# Altium schematic sheet Buck6Vto3.3V.SchDoc
size A
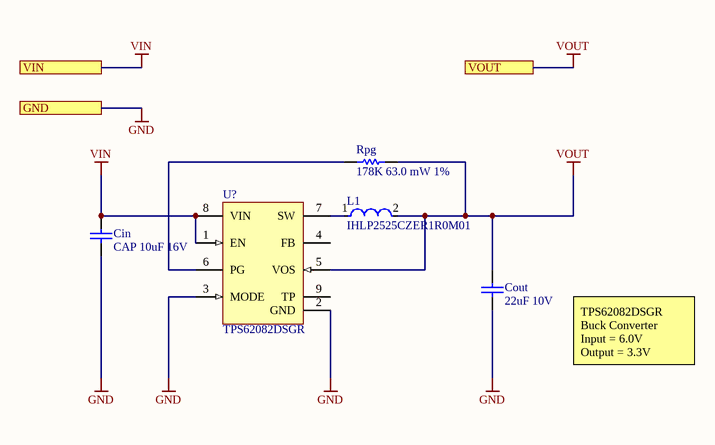
[diagram p0: Buck6Vto3.3V.SchDoc]

## Parts
Cin  CAP 10uF 16V  [CAPC0805(2012)145_N]
Cout  22uF 10V  [CAPC0805(2012)145_N]
L1  IHLP2525CZER1R0M01  [FP-IHLP-2525CZ-FP_2_413x3-MFG]
Rpg  178K 63.0 mW 1%  [RESC0603(1608)_N]
U?  TPS62082DSGR  [DSG8-1600X900TP]

## Ports
GND, VIN, VOUT

## Nets
GND: Cin.1 Cout.1 U?.2(GND) U?.3(MODE) ; port GND
VIN: Cin.2 U?.1(EN) U?.8(VIN) ; port VIN
VOUT: Cout.2 L1.2 Rpg.2 U?.5(VOS) ; port VOUT
NetL1_1: L1.1 U?.7(SW)
NetRpg_1: Rpg.1 U?.6(PG)

Not connected (* = marked no-connect by the designer): U? 4(FB) 9(TP)

## Notes on the sheet
- TPS62082DSGR
  Buck Converter
  Input = 6.0V
  Output = 3.3V

## Library data of the parts
Cin = CMP-1036-04927-1: CAP 10uF 16V ±10% 0805 (2012 Metric) Thickness 1.45mm SMD; Manufacturer: Kyocera AVX; Manufacturer Part Number: 0805YD106KAT2A; Manufacturer: KEMET; Manufacturer Part Number: C0805C106K4PACTU; Manufacturer: TDK; Manufacturer Part Number: C2012X5R1C106K/0.85; Manufacturer Part Number: C2012X6S1C106K; Manufacturer Part Number: C0805C106K4PAC; Manufacturer Part Number: 0805YD106KAT4A; Manufacturer Part Number: C2012X5R1C106K/1.25; Case-EIA: 0805; Tolerance: Â±10%; Case-Metric: 2012; Rated Voltage: 16 V; Technology: SMT; Value: 10uF; Max Thickness: 1.45 mm
Cout = CMP-1036-04943-1: CAP 22uF 10V ±20% 0805 (2012 Metric) Thickness 1.45mm SMD; Manufacturer: TDK; Manufacturer Part Number: C2012X5R1A226M/0.85; Manufacturer Part Number: C2012X5R1A226M/1.25; Manufacturer Part Number: C2012X6S1A226M; Case-Metric: 2012; Case-EIA: 0805; Tolerance: Â±20%; Rated Voltage: 10 V; Max Thickness: 1.45 mm; Technology: SMT; Value: 22uF
L1 = CMP-02424-000599-1: Commercial Inductors, High Saturation Series 1uH 11A 10mΩ 20%; Self Resonant Frequency: 5MHz; Test Frequency: 100kHz; Shielding: Shielded; Core Material: Metal; Saturation Current: 22A; DC Resistance (DCR): 10mR; Current Rating: 11A; Packaging: Tape and Reel; Width: 6.47mm; Number of Pins: 2; Case/Package: 2525; Termination: SMD/SMT; Length: 7.24mm; Height: 3mm; Min Operating Temperature: -55°C; Mount: Surface Mount; Inductance Tolerance: 20%; Max Operating Temperature: 125°C; Military Standard: Not; Max DC Current: 11A; RMS Current (Irms): 11A; Lead Free: Lead Free; Depth: 6.72mm; Tolerance: 20%; Package Quantity: 2000; Radiation Hardening: No; Contact Plating: Tin; Inductance: 1uH
Rpg = CMP-1012-00756-1: 178K  1% 0603 (1608 Metric)  SMD; Manufacturer: Panasonic; Manufacturer Part Number: ERJ-3EKF1583V; Manufacturer: Bourns; Manufacturer Part Number: CR0603-FX-1583ELF; Manufacturer: Vishay Dale; Manufacturer Part Number: CRCW0603158KFKEB; Manufacturer: Yageo; Manufacturer Part Number: RC0603FR-07158KL; Manufacturer: Vishay; Manufacturer Part Number: CRCW0603158KFKEA; Manufacturer Part Number: CRCW0603158KFKTA; Power: 0.1 W; Value: 158000.00 Ohm; Case-Metric: 1608; Case-EIA: 0603; Tolerance: 1 %; Technology: SMT
U? = CMP-0323-00344-2: Buck Step Down Regulator with 2.3 to 6 V Input and 3.3 V Output, -40 to 85 degC, 8-Pin WSON (DSG), Green (RoHS & no Sb/Br); Manufacturer: Texas Instruments; Duty Cycle(Max)(%): 100; Iq(Typ)(mA): 0.006; Rating: Catalog; Regulated Outputs(#): 1; Vout(Min)(V): 3.3; SubFamily: Step-Down Regulator; Vin(Max)(V): 6; Iout(Max)(A): 1.2; Vin(Min)(V): 2.3; Switch Current Limit(Typ)(A): 2.4; ComponentLink1Description: Datasheet; PackageReference: DSG8-1600X900TP; ComponentLink2Description: Package Specification; PackageDescription: 8-Pin Plastic Small Outline No-Lead, 2 x 2 x 0.8 mm Body, 0.5 mm Pitch, Exposed Pad; DatasheetVersion: SLVSAE8B; PackageVersion: revB, Oct-2010; Eco-Plan: Green (RoHS & no Sb/Br); Code_JEDEC: MO-229; PartNumber: TPS62082DSGR; ComponentLink1URL: http://www.ti.com/general/docs/lit/getliterature.tsp?genericPartNumber=TPS62082&fileType=pdf; ComponentLink2URL: http://www.ti.com/litv/pdf/mpds308a; ComponentLink3URL: Samples URL:http://www.ti.com/product/tps62082#samples; Mounting Technology: Surface Mount; Vout(Max)(V): 3.3; ComponentLink3Description: URL Link1; Topology: Buck